# EAGLE board SOC_mcu (EAGLE 6.2), part 1 of 2
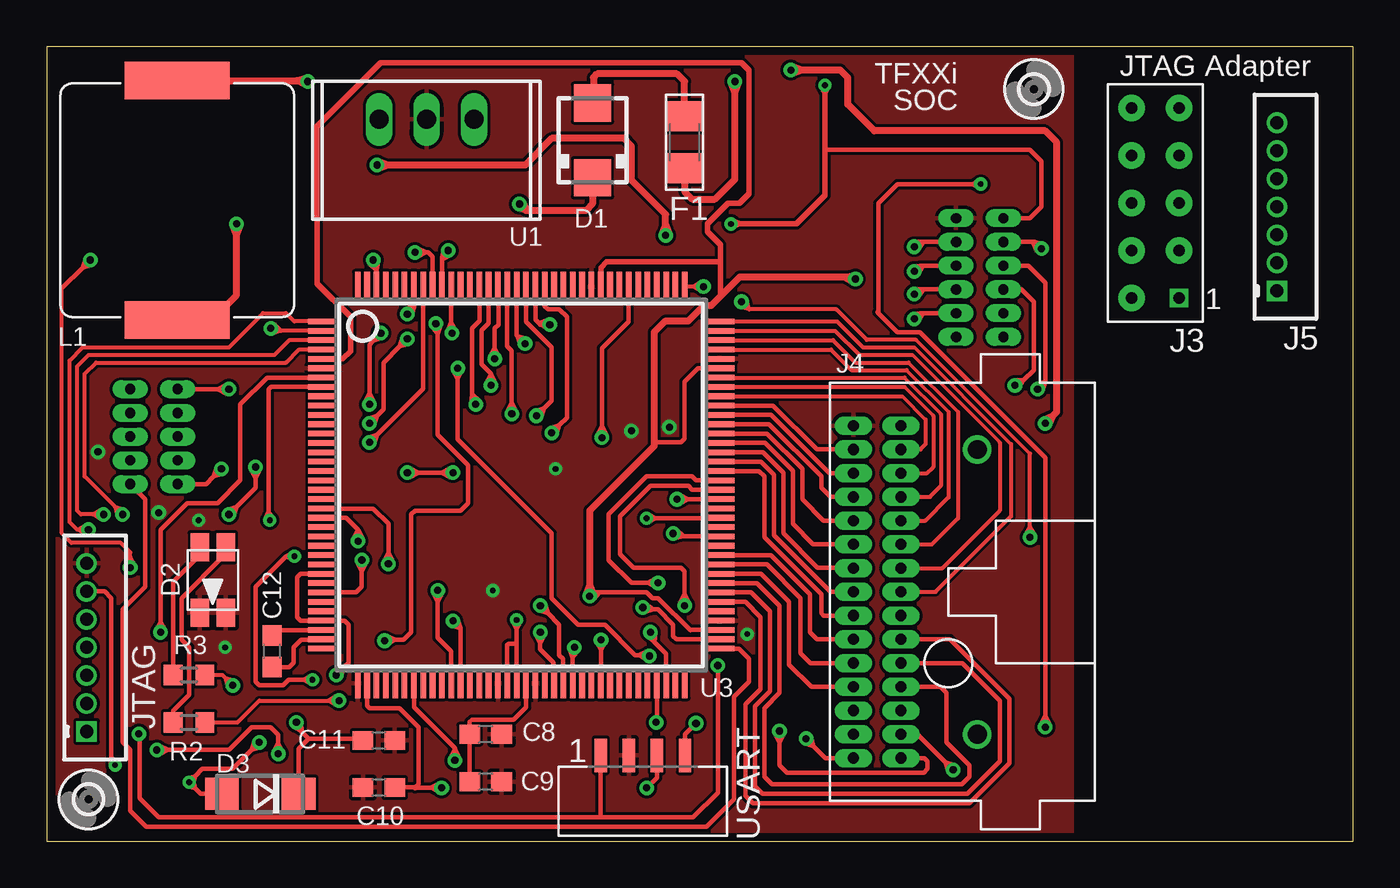
[diagram p5: board, top side]
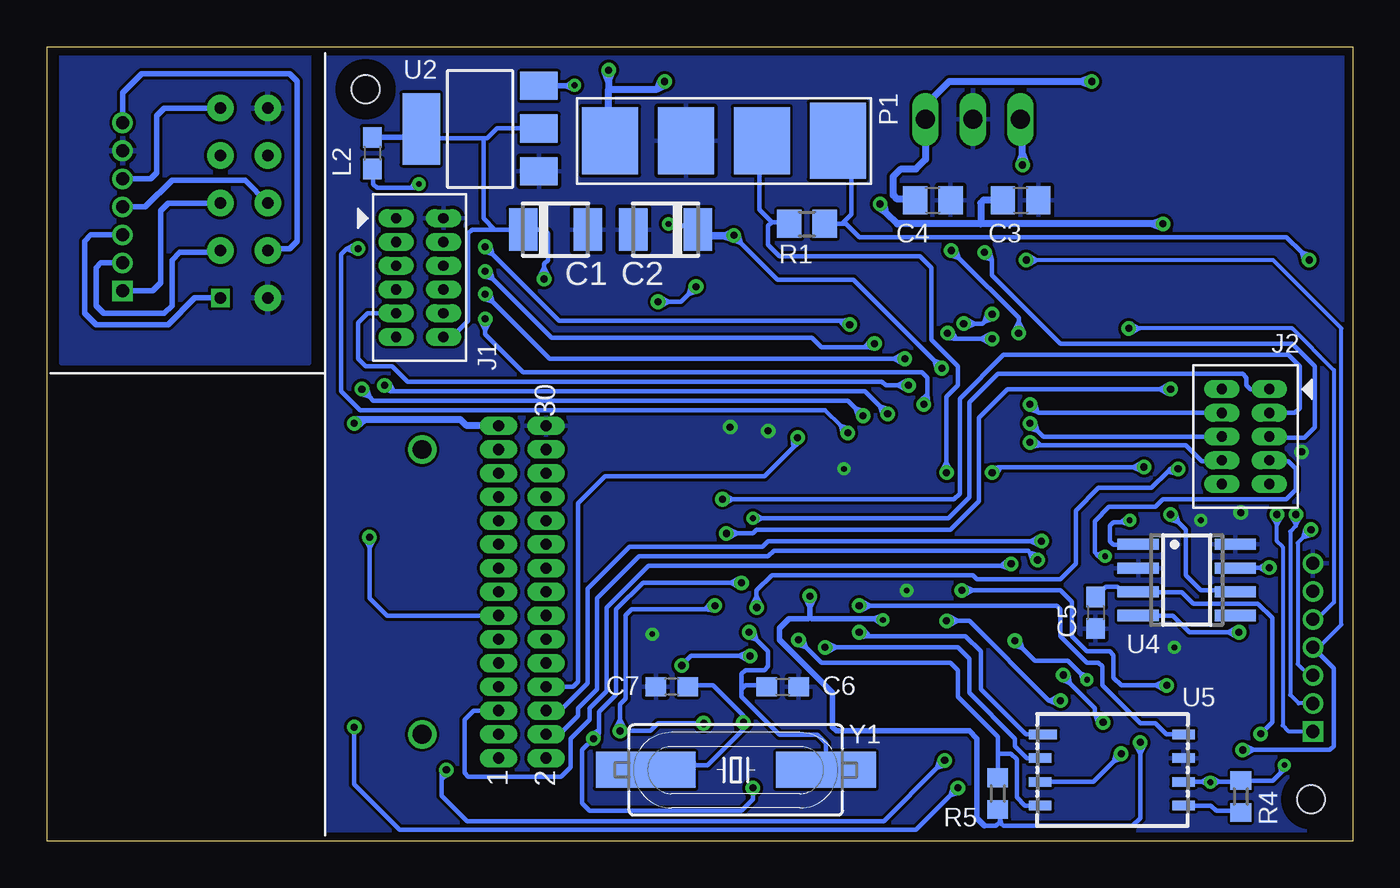
[diagram p6: board, bottom side, seen from below]

Size 69.9 x 42.5 mm. Coordinates in mm from the lower left corner, seen from the top.
Outline: 0,0 69.9,0 69.9,42.5 0,42.5 0,0
Copper layers (1*16): Top 0.018mm / dielectric 1.55mm / 22 0.018mm
Design rules: minimum track width 0.15mm, minimum drill 0.25mm, track to track 0.155mm, track to pad 0.155mm, pad to pad 0.155mm, via to via 0.155mm, smd to smd 0.155mm, copper to edge 0.45mm, drill to drill 0.3mm, minimum pad ring 0.2mm, minimum via ring 0.2mm, stop-mask expansion 0.1mm, vias tented up to drill 0mil, thermal gap 0.2mm

## Footprints (pad centres in the part's own frame; a part is rotated, then mirrored left to right if it is on the bottom)
3528-21 = smd 1.524 x 2.286: NEG 1.727,0; POS -1.727,0
C0805 = smd 1.3 x 1.5: 1 -0.95,0; 2 0.95,0
C0603 = smd 1.1 x 1: 1 -0.85,0; 2 0.85,0
SMA = smd 2 x 2: A 2,0; C -2,0
HSMF-C = smd 1.499 x 0.991: 1 -1.753,0.699; 2 1.753,0.699; 3 -1.753,-0.699; 4 1.753,-0.699
DO214AC = smd 1.8 x 1.7: A 2.05,0; C -2.05,0
1206 = smd 1.6 x 1.8: 1 -1.4,0; 2 1.4,0
1,5 = hole 1.5: 0,0
HEADER-THD-6X2(1.27X2.54) = drill 0.55 pad 0.762 long: 1 0,0; 2 0,2.54; 3 1.27,0; 4 1.27,2.54; 5 2.54,0; 6 2.54,2.54; 7 3.81,0; 8 3.81,2.54; 9 5.08,0; 10 5.08,2.54; 11 6.35,0; 12 6.35,2.54
SOCKET-THD-5X2(1.27X2.54) = drill 0.55 pad 0.762 long: P1 5.08,0; P2 5.08,2.54; P3 3.81,0; P4 3.81,2.54; P5 2.54,0; P6 2.54,2.54; P7 1.27,0; P8 1.27,2.54; P9 0,0; P10 0,2.54
5X2THD254 = drill 0.6 square: 1 5.08,1.27 | drill 0.6 pad 1.422: 2 5.08,-1.27; 3 2.54,1.27; 4 2.54,-1.27; 5 0,1.27; 6 0,-1.27; 7 -2.54,1.27; 8 -2.54,-1.27; 9 -5.08,1.27; 10 -5.08,-1.27
HEADER-THD-15X2(1.27X2.54) = drill 0.6 pad 0.813 long: 1 0,0; 2 0,2.54; 3 1.27,0; 4 1.27,2.54; 5 2.54,0; 6 2.54,2.54; 7 3.81,0; 8 3.81,2.54; 9 5.08,0; 10 5.08,2.54; 11 6.35,0; 12 6.35,2.54; 13 7.62,0; 14 7.62,2.54; 15 8.89,0; 16 8.89,2.54; 17 10.16,0; 18 10.16,2.54; 19 11.43,0; 20 11.43,2.54; 21 12.7,0; 22 12.7,2.54; 23 13.97,0; 24 13.97,2.54; 25 15.24,0; 26 15.24,2.54; 27 16.51,0; 28 16.51,2.54; 29 17.78,0; 30 17.78,2.54 | drill 1 pad 1.524: N1 1.27,-4.089; N2 16.51,-4.089
B7B-ZR = drill 0.7 pad 1.1 square: 1 -4.5,0 | drill 0.7 pad 1.1: 2 -3,0; 3 -1.5,0; 4 0,0; 5 1.5,0; 6 3,0; 7 4.5,0
PAN_COIL_CHOKE = smd 2 x 5.6: 1 -6.4,0; 2 6.4,0
0603 = smd 1.1 x 1: 1 -0.85,0; 2 0.85,0
CAN+POWER = smd 4.083 x 3: 1 0,-6.096 | smd 3.6 x 3: 2 0,-2.032; 3 0,2.032; 4 0,6.096
R0805 = smd 1.3 x 1.5: 1 -0.95,0; 2 0.95,0
R0603 = smd 1 x 1.1: 1 -0.85,0; 2 0.85,0
TO220V = drill 1.016 long: 1 -2.54,2.032; 2 0,2.032; 3 2.54,2.032
SOT223 = smd 1.499 x 2.007: 1 -2.261,-3.15; 2 0.025,-3.15; 3 2.311,-3.15 | smd 3.81 x 2.007: 4 0,3.15
TQFP144 = smd 0.3 x 1.6: 1 -8.75,-10.6; 2 -8.25,-10.6; 3 -7.75,-10.6; 4 -7.25,-10.6; 5 -6.75,-10.6; 6 -6.25,-10.6; 7 -5.75,-10.6; 8 -5.25,-10.6; 9 -4.75,-10.6; 10 -4.25,-10.6; 11 -3.75,-10.6; 12 -3.25,-10.6; 13 -2.75,-10.6; 14 -2.25,-10.6; 15 -1.75,-10.6; 16 -1.25,-10.6; 17 -0.75,-10.6; 18 -0.25,-10.6; 19 0.25,-10.6; 20 0.75,-10.6; 21 1.25,-10.6; 22 1.75,-10.6; 23 2.25,-10.6; 24 2.75,-10.6; 25 3.25,-10.6; 26 3.75,-10.6; 27 4.25,-10.6; 28 4.75,-10.6; 29 5.25,-10.6; 30 5.75,-10.6; 31 6.25,-10.6; 32 6.75,-10.6; 33 7.25,-10.6; 34 7.75,-10.6; 35 8.25,-10.6; 36 8.75,-10.6; 73 8.75,10.6; 74 8.25,10.6; 75 7.75,10.6; 76 7.25,10.6; 77 6.75,10.6; 78 6.25,10.6; 79 5.75,10.6; 80 5.25,10.6; 81 4.75,10.6; 82 4.25,10.6; 83 3.75,10.6; 84 3.25,10.6; 85 2.75,10.6; 86 2.25,10.6; 87 1.75,10.6; 88 1.25,10.6; 89 0.75,10.6; 90 0.25,10.6; 91 -0.25,10.6; 92 -0.75,10.6; 93 -1.25,10.6; 94 -1.75,10.6; 95 -2.25,10.6; 96 -2.75,10.6; 97 -3.25,10.6; 98 -3.75,10.6; 99 -4.25,10.6; 100 -4.75,10.6; 101 -5.25,10.6; 102 -5.75,10.6; 103 -6.25,10.6; 104 -6.75,10.6; 105 -7.25,10.6; 106 -7.75,10.6; 107 -8.25,10.6; 108 -8.75,10.6 | smd 1.6 x 0.3: 37 10.6,-8.75; 38 10.6,-8.25; 39 10.6,-7.75; 40 10.6,-7.25; 41 10.6,-6.75; 42 10.6,-6.25; 43 10.6,-5.75; 44 10.6,-5.25; 45 10.6,-4.75; 46 10.6,-4.25; 47 10.6,-3.75; 48 10.6,-3.25; 49 10.6,-2.75; 50 10.6,-2.25; 51 10.6,-1.75; 52 10.6,-1.25; 53 10.6,-0.75; 54 10.6,-0.25; 55 10.6,0.25; 56 10.6,0.75; 57 10.6,1.25; 58 10.6,1.75; 59 10.6,2.25; 60 10.6,2.75; 61 10.6,3.25; 62 10.6,3.75; 63 10.6,4.25; 64 10.6,4.75; 65 10.6,5.25; 66 10.6,5.75; 67 10.6,6.25; 68 10.6,6.75; 69 10.6,7.25; 70 10.6,7.75; 71 10.6,8.25; 72 10.6,8.75; 109 -10.6,8.75; 110 -10.6,8.25; 111 -10.6,7.75; 112 -10.6,7.25; 113 -10.6,6.75; 114 -10.6,6.25; 115 -10.6,5.75; 116 -10.6,5.25; 117 -10.6,4.75; 118 -10.6,4.25; 119 -10.6,3.75; 120 -10.6,3.25; 121 -10.6,2.75; 122 -10.6,2.25; 123 -10.6,1.75; 124 -10.6,1.25; 125 -10.6,0.75; 126 -10.6,0.25; 127 -10.6,-0.25; 128 -10.6,-0.75; 129 -10.6,-1.25; 130 -10.6,-1.75; 131 -10.6,-2.25; 132 -10.6,-2.75; 133 -10.6,-3.25; 134 -10.6,-3.75; 135 -10.6,-4.25; 136 -10.6,-4.75; 137 -10.6,-5.25; 138 -10.6,-5.75; 139 -10.6,-6.25; 140 -10.6,-6.75; 141 -10.6,-7.25; 142 -10.6,-7.75; 143 -10.6,-8.25; 144 -10.6,-8.75
SO08 = smd 0.6 x 2.2: 1 -1.905,-2.6; 2 -0.635,-2.6; 3 0.635,-2.6; 4 1.905,-2.6; 5 1.905,2.6; 6 0.635,2.6; 7 -0.635,2.6; 8 -1.905,2.6
8CN3 = smd 1.524 x 0.508: 1 -3.937,1.905 | smd 1.219 x 0.508: 2 -4.089,0.635; 3 -4.089,-0.635; 4 -4.089,-1.905; 5 3.59,-1.905; 6 3.59,-0.635; 7 3.59,0.635; 8 3.59,1.905
SM4-TF = smd 0.65 x 1.8: 1 -2.25,-0.9; 2 -0.75,-0.9; 3 0.75,-0.9; 4 2.25,-0.9
HC49UP = smd 5.334 x 1.93: 1 -4.826,0; 2 4.826,0

## Placement (x,y rotation side)
C1  100uF  [3528-21]  42.67,32.72 0 bottom
C2  10uF  [3528-21]  36.78,32.72 180 bottom
C3  4.7uF  [C0805]  17.78,34.29 0 bottom
C4  4.7uF  [C0805]  22.48,34.29 0 bottom
C5  100n  [C0603]  13.77,12.22 270 bottom
C6  22p  [C0603]  30.51,8.26 0 bottom
C7  22p  [C0603]  36.45,8.26 180 bottom
C8  470p  [C0603]  23.5,5.71 180 top
C9  2.2u  [C0603]  23.5,3.17 180 top
C10  100n  [C0603]  17.78,2.87 180 top
C11  100n  [C0603]  17.78,5.38 0 top
C12  100n  [C0603]  12.06,10.16 90 top
D1  MBRA340T3  [SMA]  29.21,37.49 90 top
D2  HSMF-C155  [HSMF-C]  8.89,13.97 270 top
D3  MRA4003T3G  [DO214AC]  11.43,2.54 180 top
F1  SMDC050F-0.5A-1206  [1206]  34.14,37.39 90 top
H1  MOUNT-HOLE1.5  [1,5]  2.24,2.24 0 top
H2  MOUNT-HOLE1.5  [1,5]  52.83,40.23 0 top
J1  HEADER-6X2-1.27-2.54  [HEADER-THD-6X2(1.27X2.54)]  51.21,33.32 270 bottom
J2  SOCKET-5X2-1.27X2.54  [SOCKET-THD-5X2(1.27X2.54)]  4.47,19.1 90 bottom
J3  PIN5X2THD254  [5X2THD254]  59.33,34.14 270 top
J4  HEADER-15X2-1.27X2.54  [HEADER-THD-15X2(1.27X2.54)]  45.72,4.45 90 top
J5  B7B-ZR  [B7B-ZR]  65.84,33.93 90 top
JTAG  B7B-ZR  [B7B-ZR]  2.13,10.36 90 top
L1  ETQP6F8R2HFA  [PAN_COIL_CHOKE]  6.99,34.29 90 top
L2  BLM18H  [0603]  52.48,36.8 270 bottom
P1  PADS4  [CAN+POWER]  33.66,37.47 90 bottom
R1  120  [R0805]  29.21,33.02 0 bottom
R2  68  [R0603]  7.62,6.35 180 top
R3  68  [R0603]  7.62,8.89 180 top
R4  100k  [R0603]  5.99,2.39 270 bottom
R5  100k  [R0603]  19,2.54 90 bottom
U1  TSR1-2450  [TO220V]  20.32,40.64 180 top
U2  TLV1117-33  [SOT223]  46.71,38.1 90 bottom
U3  ATUC3C0512C  [TQFP144]  25.4,19.05 270 top
U4  MCP2551  [SO08]  8.89,13.97 270 bottom
U5  AT45DB642D-SPI  [8CN3]  12.65,3.81 0 bottom
USART  B4B-ZRSMT  [SM4-TF]  31.9,5.49 0 top
Y1  CRYSTAL_49SMX  [HC49UP]  33.02,3.81 0 bottom

## Tracks (layer width: path | path; a pad name or v marks a point on that pad's centre or on a via)
!TFT_CS
  Top 0.254: U3.79 37.69,13.31 38.71,12.29 38.71,8.03 37.9,7.21 37.9,2.95 38.3,2.54 49.28,2.54 51,4.27 51,7.52 49,9.53 J4.9
!TFT_RD
  Top 0.254: U3.83 38.75,15.3 40.84,13.21 40.84,11.18 41.22,10.79 J4.12
!TFT_RESET  (via drill 0.38)
  Top 0.254: U3.81 38.23,14.3 39.73,12.8 39.73,9.45 40.92,8.26 J4.8 | v29.72,21.59 29.72,22.16 | 29.72,22.16 29.72,26.36 31.15,27.8 U3.115 | 29.72,22.16 | 29.72,22.16 29.48,21.71 | v29.72,21.59 29.48,21.71 | 29.72,22.16 | 29.72,22.16 29.95,21.71 | v29.72,21.59 29.95,21.71 | 29.72,22.16 29.48,21.71 | 29.48,21.71 | v29.72,21.59 29.48,21.71 | 29.72,22.16 29.95,21.71 | v29.72,21.59 29.95,21.71 | 29.72,22.16 29.48,21.71 | v29.72,21.59 29.48,21.71 | 29.72,22.16 29.95,21.71 | v29.72,21.59 29.95,21.71
  22 0.254: J4.8 41.73,8.26 41.45,8.53 41.45,18.09 40.03,19.51 31.5,19.51 29.94,21.06 | 29.94,21.06 29.72,21.29 v29.72,21.59 | 29.94,21.06 29.98,21.57 v29.72,21.59 | 29.94,21.06 29.55,21.39 v29.72,21.59
!TFT_WR
  Top 0.254: J4.11 48.34,10.79 51.51,7.62 51.51,4.17 49.38,2.03 37.8,2.03 37.39,2.44 37.39,7.32 38.2,8.13 38.2,11.99 37.39,12.8 U3.78
CAN_H  (via drill 0.38)
  Top 0.203: 0.81,29.57 0.81,16.46 1.32,15.95 3.96,15.95 4.47,15.44 4.47,15.2 | v4.47,14.63 4.47,15.2 | 4.47,15.2 | 4.47,15.2 | 4.47,15.2 4.22,14.78 | v4.47,14.63 4.22,14.78 | 4.47,15.2 4.72,14.78 | v4.47,14.63 4.72,14.78 | 4.47,15.2 4.22,14.78 | v4.47,14.63 4.22,14.78 | 4.47,15.2 4.72,14.78 | v4.47,14.63 4.72,14.78 | 4.47,15.2 4.22,14.78 | v4.47,14.63 4.22,14.78 | 4.47,15.2 4.72,14.78 | v4.47,14.63 4.72,14.78
  Top 0.254: 0.81,29.57 1.93,30.68 | 1.93,30.68 v2.34,31.09 | 1.93,30.68 2.42,30.84 v2.34,31.09 | 1.93,30.68 2.09,31.17 v2.34,31.09
  22 0.203: 6.26,14.63 U4.7
  22 0.254: R1.2 27.33,33.02 | v4.47,14.63 5.04,14.63 | 5.04,14.63 6.26,14.63 | v2.34,31.09 2.74,31.49 | 2.74,31.49 3.56,32.31 26.42,32.31 27.13,33.02 27.33,33.02 | 26.82,35.97 26.82,33.53 27.33,33.02 | 2.74,31.49 2.26,31.34 v2.34,31.09 | 2.74,31.49 2.59,31.01 v2.34,31.09 | 5.04,14.63 4.59,14.86 | v4.47,14.63 4.59,14.86 | 5.04,14.63 4.59,14.4 | v4.47,14.63 4.59,14.4 | 5.04,14.63 4.59,14.86 | 4.59,14.86 | v4.47,14.63 4.59,14.86 | 5.04,14.63 4.59,14.4 | v4.47,14.63 4.59,14.4 | 5.04,14.63 4.59,14.86 | v4.47,14.63 4.59,14.86 | 5.04,14.63 4.59,14.4 | v4.47,14.63 4.59,14.4
  22 0.381: P1.1 27.56,36.7 26.82,35.97
CAN_L  (via drill 0.38)
  Top 0.254: v21.74,19.71 21.17,19.71 | 21.17,19.71 19.88,19.71 | 19.88,19.71 v19.3,19.71 | v11.18,20.02 11.18,19.44 | 11.18,19.44 11.18,18.9 10.16,17.88 | 10.16,17.88 v9.75,17.48 | 21.17,19.71 | 21.17,19.71 21.62,19.48 | v21.74,19.71 21.62,19.48 | 21.17,19.71 | 21.17,19.71 21.62,19.94 | v21.74,19.71 21.62,19.94 | 21.17,19.71 21.62,19.48 | 21.62,19.48 | v21.74,19.71 21.62,19.48 | 21.17,19.71 21.62,19.94 | v21.74,19.71 21.62,19.94 | 21.17,19.71 21.62,19.48 | v21.74,19.71 21.62,19.48 | 21.17,19.71 21.62,19.94 | v21.74,19.71 21.62,19.94 | 19.88,19.71 19.43,19.94 | v19.3,19.71 19.43,19.94 | 19.88,19.71 19.43,19.48 | v19.3,19.71 19.43,19.48 | 19.88,19.71 19.43,19.94 | 19.43,19.94 | v19.3,19.71 19.43,19.94 | 19.88,19.71 19.43,19.48 | v19.3,19.71 19.43,19.48 | 19.88,19.71 19.43,19.94 | v19.3,19.71 19.43,19.94 | 19.88,19.71 19.43,19.48 | v19.3,19.71 19.43,19.48 | 11.18,19.44 11.41,19.89 | v11.18,20.02 11.41,19.89 | 11.18,19.44 10.94,19.89 | v11.18,20.02 10.94,19.89 | 11.18,19.44 11.41,19.89 | 11.41,19.89 | v11.18,20.02 11.41,19.89 | 11.18,19.44 10.94,19.89 | v11.18,20.02 10.94,19.89 | 11.18,19.44 11.41,19.89 | v11.18,20.02 11.41,19.89 | 11.18,19.44 10.94,19.89 | v11.18,20.02 10.94,19.89 | 10.16,17.88 9.67,17.73 v9.75,17.48 | 10.16,17.88 10.01,17.4 v9.75,17.48
  22 0.203: 6.37,13.41 U4.6
  22 0.254: P1.2 31.75,36.83 31.75,33.78 31.09,33.12 | v9.75,17.48 9.35,17.07 | 9.35,17.07 8.94,16.66 8.94,14.22 8.13,13.41 6.37,13.41 | 21.74,20.28 21.74,23.77 21.13,24.38 21.13,25.4 22.55,26.82 22.55,30.68 23.16,31.29 30.68,31.29 31.29,31.9 31.29,32.92 31.09,33.12 | 21.74,20.28 v21.74,19.71 | v11.18,20.02 11.75,20.02 | 11.75,20.02 18.82,20.02 | 18.82,20.02 19,20.02 v19.3,19.71 | 31.09,33.12 30.16,33.12 | 21.74,20.28 | 21.74,20.28 21.51,19.83 | v21.74,19.71 21.51,19.83 | 21.74,20.28 | 21.74,20.28 21.98,19.83 | v21.74,19.71 21.98,19.83 | 21.74,20.28 21.51,19.83 | 21.51,19.83 | v21.74,19.71 21.51,19.83 | 21.74,20.28 21.98,19.83 | v21.74,19.71 21.98,19.83 | 21.74,20.28 21.51,19.83 | v21.74,19.71 21.51,19.83 | 21.74,20.28 21.98,19.83 | v21.74,19.71 21.98,19.83 | 18.82,20.02 19.08,19.58 v19.3,19.71 | 18.82,20.02 19.33,19.97 v19.3,19.71 | 11.75,20.02 11.3,20.25 | v11.18,20.02 11.3,20.25 | 11.75,20.02 11.3,19.78 | v11.18,20.02 11.3,19.78 | 11.75,20.02 11.3,20.25 | 11.3,20.25 | v11.18,20.02 11.3,20.25 | 11.75,20.02 11.3,19.78 | v11.18,20.02 11.3,19.78 | 11.75,20.02 11.3,20.25 | v11.18,20.02 11.3,20.25 | 11.75,20.02 11.3,19.78 | v11.18,20.02 11.3,19.78 | 9.35,17.07 9.83,17.22 v9.75,17.48 | 9.35,17.07 9.5,17.55 v9.75,17.48
  22 0.381: 30.16,33.12 R1.1
CAN_RXD0  (via drill 0.38)
  Top 0.203: U3.7
  Top 0.254: v6.1,11.18 6.1,11.75 | 6.1,11.75 6.1,16.66 7.52,18.09 9.14,18.09 10.36,19.3 10.36,23.37 11.79,24.79 U3.7 | 6.1,11.75 | 6.1,11.75 5.86,11.3 | v6.1,11.18 5.86,11.3 | 6.1,11.75 | 6.1,11.75 6.33,11.3 | v6.1,11.18 6.33,11.3 | 6.1,11.75 5.86,11.3 | 5.86,11.3 | v6.1,11.18 5.86,11.3 | 6.1,11.75 6.33,11.3 | v6.1,11.18 6.33,11.3 | 6.1,11.75 5.86,11.3 | v6.1,11.18 5.86,11.3 | 6.1,11.75 6.33,11.3 | v6.1,11.18 6.33,11.3
  22 0.254: 6.67,11.18 8.74,11.18 9.63,12.06 U4.4 | 6.67,11.18 v6.1,11.18 | 6.67,11.18 6.22,11.41 | v6.1,11.18 6.22,11.41 | 6.67,11.18 6.22,10.94 | v6.1,11.18 6.22,10.94 | 6.67,11.18 6.22,11.41 | 6.22,11.41 | v6.1,11.18 6.22,11.41 | 6.67,11.18 6.22,10.94 | v6.1,11.18 6.22,10.94 | 6.67,11.18 6.22,11.41 | v6.1,11.18 6.22,11.41 | 6.67,11.18 6.22,10.94 | v6.1,11.18 6.22,10.94
CAN_TXD0  (via drill 0.3)
  Top 0.254: U3.8 12.01,24.3 11.89,24.18 11.89,17.62 | 11.89,17.62 11.89,17.22 v11.94,17.17 | 11.89,17.62 11.73,17.26 v11.94,17.17 | 11.89,17.62 12.12,17.3 v11.94,17.17
  22 0.15: 11.68,16 U4.1
  22 0.254: 11.68,16 12.04,16 12.19,15.85 12.8,15.85 13.01,16.05 13.01,16.87 12.8,17.07 12.38,17.07 | 12.38,17.07 12.04,17.07 v11.94,17.17 | 12.38,17.07 12.09,17.34 v11.94,17.17 | 12.38,17.07 12,16.95 v11.94,17.17
CMOS_D0  (via drill 0.38)
  Top 0.254: U3.124 26.65,28.62 26.82,28.45 27.43,28.45 27.84,28.04 27.84,22.66 27.43,22.25 | 27.43,22.25 v27.03,21.84 | J1.3 52.79,32.05 | 52.79,32.05 52.88,32.05 v53.24,31.7 | 52.79,32.05 53,31.59 v53.24,31.7 | 52.79,32.05 53.29,31.96 v53.24,31.7 | 27.43,22.25 26.95,22.09 v27.03,21.84 | 27.43,22.25 27.28,21.77 v27.03,21.84
  22 0.203: 28.25,23.06 27.43,22.25 | 27.43,22.25 v27.03,21.84 | 27.43,22.25 26.95,22.12 v27.03,21.84 | 27.43,22.25 27.3,21.77 v27.03,21.84
  22 0.254: 28.25,23.06 53.14,23.06 54.15,24.08 54.15,31.39 53.85,31.7 53.81,31.7 | 53.81,31.7 v53.24,31.7 | 53.81,31.7 53.36,31.93 | v53.24,31.7 53.36,31.93 | 53.81,31.7 53.36,31.46 | v53.24,31.7 53.36,31.46 | 53.81,31.7 53.36,31.93 | 53.36,31.93 | v53.24,31.7 53.36,31.93 | 53.81,31.7 53.36,31.46 | v53.24,31.7 53.36,31.46 | 53.81,31.7 53.36,31.93 | v53.24,31.7 53.36,31.93 | 53.81,31.7 53.36,31.46 | v53.24,31.7 53.36,31.46
CMOS_D1  (via drill 0.38)
  Top 0.254: U3.125 26.15,27.9 26.36,27.7 | 26.36,27.7 26.42,27.64 v26.92,27.64 | J1.4 46.94,32.05 | 46.94,32.05 46.69,32.05 v46.43,31.8 | 46.94,32.05 46.44,32.06 v46.43,31.8 | 46.94,32.05 46.64,31.64 v46.43,31.8 | 26.36,27.7 26.78,27.42 v26.92,27.64 | 26.36,27.7 26.83,27.88 v26.92,27.64
  22 0.254: 27.46,27.84 42.47,27.84 46.03,31.4 | 27.46,27.84 27.13,27.84 v26.92,27.64 | 46.03,31.4 v46.43,31.8 | 46.03,31.4 46.51,31.55 v46.43,31.8 | 46.03,31.4 46.18,31.88 v46.43,31.8 | 27.46,27.84 26.95,27.9 v26.92,27.64 | 27.46,27.84 27.12,27.46 v26.92,27.64
CMOS_D2  (via drill 0.38)
  Top 0.254: v53.03,24.18 53.44,24.59 | 53.44,24.59 53.44,29.87 52.53,30.79 J1.5 | U3.126 25.65,27.79 27.03,26.42 27.03,23.57 26.62,23.16 | 26.62,23.16 v26.21,22.76 | 26.62,23.16 26.13,23.01 v26.21,22.76 | 26.62,23.16 26.46,22.68 v26.21,22.76 | 53.44,24.59 52.96,24.43 v53.03,24.18 | 53.44,24.59 53.29,24.1 v53.03,24.18
  22 0.254: 26.62,23.16 27.03,23.57 52.43,23.57 52.63,23.78 | 26.62,23.16 v26.21,22.76 | 52.63,23.78 v53.03,24.18 | 26.62,23.16 26.13,23.01 v26.21,22.76 | 26.62,23.16 26.46,22.68 v26.21,22.76 | 52.63,23.78 53.12,23.93 v53.03,24.18 | 52.63,23.78 52.78,24.26 v53.03,24.18
CMOS_D3  (via drill 0.38)
  Top 0.254: J1.6 46.91,30.79 | 46.91,30.79 46.74,30.79 v46.43,30.48 | U3.127 25.15,27.07 25.2,27.02 | 25.2,27.02 v25.6,26.62 | 46.91,30.79 46.41,30.74 v46.43,30.48 | 46.91,30.79 46.66,30.35 v46.43,30.48 | 25.2,27.02 25.35,26.54 v25.6,26.62 | 25.2,27.02 25.68,26.87 v25.6,26.62
  22 0.254: 46.03,30.08 42.88,26.92 28.96,26.92 28.45,26.42 26.14,26.42 | 46.03,30.08 v46.43,30.48 | 26.14,26.42 25.81,26.42 v25.6,26.62 | 46.03,30.08 46.51,30.23 v46.43,30.48 | 46.03,30.08 46.18,30.56 v46.43,30.48 | 26.14,26.42 25.8,26.8 v25.6,26.62 | 26.14,26.42 25.63,26.36 v25.6,26.62
CMOS_D4  (via drill 0.38)
  Top 0.254: U3.128 24.65,26.48 24.89,26.24 24.89,23.43 | v24.89,22.86 24.89,23.43 | v51.82,24.38 52.02,24.38 52.31,24.67 | 52.31,24.67 52.83,25.2 52.83,28.85 52.17,29.52 J1.7 | 52.31,24.67 51.8,24.65 v51.82,24.38 | 52.31,24.67 52.04,24.24 v51.82,24.38 | 24.89,23.43 | 24.89,23.43 24.66,22.98 | v24.89,22.86 24.66,22.98 | 24.89,23.43 | 24.89,23.43 25.13,22.98 | v24.89,22.86 25.13,22.98 | 24.89,23.43 24.66,22.98 | 24.66,22.98 | v24.89,22.86 24.66,22.98 | 24.89,23.43 25.13,22.98 | v24.89,22.86 25.13,22.98 | 24.89,23.43 24.66,22.98 | v24.89,22.86 24.66,22.98 | 24.89,23.43 25.13,22.98 | v24.89,22.86 25.13,22.98
  22 0.254: 51.33,24.08 51.51,24.08 v51.82,24.38 | 51.33,24.08 26.11,24.08 25.3,23.26 | v24.89,22.86 25.3,23.26 | 51.33,24.08 51.84,24.12 v51.82,24.38 | 51.33,24.08 51.59,24.52 v51.82,24.38 | 25.3,23.26 24.81,23.11 v24.89,22.86 | 25.3,23.26 25.14,22.78 v24.89,22.86
CMOS_D5  (via drill 0.38)
  Top 0.203: 24.18,29.62 U3.129
  Top 0.254: v23.98,25.81 23.98,26.38 | 23.98,26.38 23.98,27.43 24.18,27.64 24.18,29.62 | J1.8 46.94,29.52 | 46.94,29.52 46.69,29.52 v46.43,29.26 | 46.94,29.52 46.44,29.52 v46.43,29.26 | 46.94,29.52 46.64,29.11 v46.43,29.26 | 23.98,26.38 | 23.98,26.38 23.74,25.93 | v23.98,25.81 23.74,25.93 | 23.98,26.38 | 23.98,26.38 24.21,25.93 | v23.98,25.81 24.21,25.93 | 23.98,26.38 23.74,25.93 | 23.74,25.93 | v23.98,25.81 23.74,25.93 | 23.98,26.38 24.21,25.93 | v23.98,25.81 24.21,25.93 | 23.98,26.38 23.74,25.93 | v23.98,25.81 23.74,25.93 | 23.98,26.38 24.21,25.93 | v23.98,25.81 24.21,25.93
  22 0.254: v23.98,25.81 24.55,25.81 | 24.55,25.81 42.98,25.81 46.03,28.86 | 46.03,28.86 v46.43,29.26 | 46.03,28.86 46.51,29.01 v46.43,29.26 | 46.03,28.86 46.18,29.34 v46.43,29.26 | 24.55,25.81 24.1,26.04 | v23.98,25.81 24.1,26.04 | 24.55,25.81 24.1,25.57 | v23.98,25.81 24.1,25.57 | 24.55,25.81 24.1,26.04 | 24.1,26.04 | v23.98,25.81 24.1,26.04 | 24.55,25.81 24.1,25.57 | v23.98,25.81 24.1,25.57 | 24.55,25.81 24.1,26.04 | v23.98,25.81 24.1,26.04 | 24.55,25.81 24.1,25.57 | v23.98,25.81 24.1,25.57
CMOS_D6  (via drill 0.38)
  Top 0.254: U3.130 23.65,27.71 23.27,27.33 23.27,25.5 23.77,24.99 23.77,24.96 | 23.77,24.96 v23.77,24.38 | 23.77,24.96 | 23.77,24.96 23.54,24.5 | v23.77,24.38 23.54,24.5 | 23.77,24.96 | 23.77,24.96 24.01,24.5 | v23.77,24.38 24.01,24.5 | 23.77,24.96 23.54,24.5 | 23.54,24.5 | v23.77,24.38 23.54,24.5 | 23.77,24.96 24.01,24.5 | v23.77,24.38 24.01,24.5 | 23.77,24.96 23.54,24.5 | v23.77,24.38 23.54,24.5 | 23.77,24.96 24.01,24.5 | v23.77,24.38 24.01,24.5
  22 0.254: J1.9 52.73,28.25 53.24,27.74 53.24,25.81 52.83,25.4 51.41,25.4 50.6,24.59 25.2,24.59 24.99,24.38 24.35,24.38 | v23.77,24.38 24.35,24.38 | 24.35,24.38 23.9,24.62 | v23.77,24.38 23.9,24.62 | 24.35,24.38 23.9,24.15 | v23.77,24.38 23.9,24.15 | 24.35,24.38 23.9,24.62 | 23.9,24.62 | v23.77,24.38 23.9,24.62 | 24.35,24.38 23.9,24.15 | v23.77,24.38 23.9,24.15 | 24.35,24.38 23.9,24.62 | v23.77,24.38 23.9,24.62 | 24.35,24.38 23.9,24.15 | v23.77,24.38 23.9,24.15
CMOS_D7  (via drill 0.38)
  Top 0.203: 23.16,29.64 U3.131
  Top 0.254: 23.16,29.64 23.16,27.84 22.76,27.43 22.76,23.9 | 22.76,23.9 22.76,23.57 v22.96,23.37 | J1.10 46.91,28.25 | 46.91,28.25 46.74,28.25 v46.43,27.94 | 46.91,28.25 46.41,28.2 v46.43,27.94 | 46.91,28.25 46.66,27.81 v46.43,27.94 | 22.76,23.9 22.7,23.4 v22.96,23.37 | 22.76,23.9 23.14,23.57 v22.96,23.37
  22 0.254: 22.76,23.9 22.76,24.79 23.06,25.09 44.4,25.09 46.43,27.13 46.43,27.37 | 22.76,23.9 22.76,23.57 v22.96,23.37 | 46.43,27.37 v46.43,27.94 | 46.43,27.37 46.66,27.82 | v46.43,27.94 46.66,27.82 | 46.43,27.37 46.2,27.82 | v46.43,27.94 46.2,27.82 | 46.43,27.37 46.66,27.82 | 46.66,27.82 | v46.43,27.94 46.66,27.82 | 46.43,27.37 46.2,27.82 | v46.43,27.94 46.2,27.82 | 46.43,27.37 46.66,27.82 | v46.43,27.94 46.66,27.82 | 46.43,27.37 46.2,27.82 | v46.43,27.94 46.2,27.82 | 22.76,23.9 22.7,23.4 v22.96,23.37 | 22.76,23.9 23.14,23.57 v22.96,23.37
CMOS_EXTCLK  (via drill 0.38)
  Top 0.254: J2.P2 9.18,24.18 | 9.18,24.18 v9.75,24.18 | U3.85 34.08,16.3 | 34.08,16.3 33.69,16.3 v33.53,16.46 | 9.18,24.18 | 9.18,24.18 9.63,23.95 | v9.75,24.18 9.63,23.95 | 9.18,24.18 | 9.18,24.18 9.63,24.41 | v9.75,24.18 9.63,24.41 | 9.18,24.18 9.63,23.95 | 9.63,23.95 | v9.75,24.18 9.63,23.95 | 9.18,24.18 9.63,24.41 | v9.75,24.18 9.63,24.41 | 9.18,24.18 9.63,23.95 | v9.75,24.18 9.63,23.95 | 9.18,24.18 9.63,24.41 | v9.75,24.18 9.63,24.41 | 34.08,16.3 33.71,16.65 v33.53,16.46 | 34.08,16.3 33.58,16.2 v33.53,16.46
  22 0.254: v9.75,24.18 10.32,24.18 | 10.32,24.18 18.49,24.18 20.02,22.66 20.02,18.19 21.54,16.66 31.9,16.66 32.11,16.46 32.96,16.46 | 32.96,16.46 v33.53,16.46 | 10.32,24.18 9.88,24.41 | v9.75,24.18 9.88,24.41 | 10.32,24.18 9.88,23.95 | v9.75,24.18 9.88,23.95 | 10.32,24.18 9.88,24.41 | 9.88,24.41 | v9.75,24.18 9.88,24.41 | 10.32,24.18 9.88,23.95 | v9.75,24.18 9.88,23.95 | 10.32,24.18 9.88,24.41 | v9.75,24.18 9.88,24.41 | 10.32,24.18 9.88,23.95 | v9.75,24.18 9.88,23.95 | 32.96,16.46 | 32.96,16.46 33.41,16.23 | v33.53,16.46 33.41,16.23 | 32.96,16.46 | 32.96,16.46 33.41,16.69 | v33.53,16.46 33.41,16.69 | 32.96,16.46 33.41,16.23 | 33.41,16.23 | v33.53,16.46 33.41,16.23 | 32.96,16.46 33.41,16.69 | v33.53,16.46 33.41,16.69 | 32.96,16.46 33.41,16.23 | v33.53,16.46 33.41,16.23 | 32.96,16.46 33.41,16.69 | v33.53,16.46 33.41,16.69
CMOS_FV  (via drill 0.38)
  Top 0.254: 21.18,31.29 v21.49,31.6 | v17.27,23.37 17.27,23.94 | 17.27,23.94 17.27,26.57 17.48,26.77 | 17.48,26.77 v17.88,27.18 | U3.135 21.15,31.14 | 21.15,31.14 21.15,31.26 v21.49,31.6 | 21.15,31.14 21.61,31.36 v21.49,31.6 | 21.15,31.14 21.23,31.64 v21.49,31.6 | 17.48,26.77 17.96,26.93 v17.88,27.18 | 17.48,26.77 17.63,27.26 v17.88,27.18 | 17.27,23.94 | 17.27,23.94 17.04,23.49 | v17.27,23.37 17.04,23.49 | 17.27,23.94 | 17.27,23.94 17.51,23.49 | v17.27,23.37 17.51,23.49 | 17.27,23.94 17.04,23.49 | 17.04,23.49 | v17.27,23.37 17.04,23.49 | 17.27,23.94 17.51,23.49 | v17.27,23.37 17.51,23.49 | 17.27,23.94 17.04,23.49 | v17.27,23.37 17.04,23.49 | 17.27,23.94 17.51,23.49 | v17.27,23.37 17.51,23.49
  22 0.254: 21.08,31.19 17.88,27.99 17.88,27.75 | 21.08,31.19 v21.49,31.6 | v17.88,27.18 17.88,27.75 | J2.P4 16.82,22.91 16.87,22.96 | 16.87,22.96 v17.27,23.37 | 21.08,31.19 21.57,31.35 v21.49,31.6 | 21.08,31.19 21.24,31.68 v21.49,31.6 | 17.88,27.75 | 17.88,27.75 17.65,27.3 | v17.88,27.18 17.65,27.3 | 17.88,27.75 | 17.88,27.75 18.11,27.3 | v17.88,27.18 18.11,27.3 | 17.88,27.75 17.65,27.3 | 17.65,27.3 | v17.88,27.18 17.65,27.3 | 17.88,27.75 18.11,27.3 | v17.88,27.18 18.11,27.3 | 17.88,27.75 17.65,27.3 | v17.88,27.18 17.65,27.3 | 17.88,27.75 18.11,27.3 | v17.88,27.18 18.11,27.3 | 16.87,22.96 17.35,23.12 v17.27,23.37 | 16.87,22.96 17.02,23.45 v17.27,23.37
CMOS_LV  (via drill 0.38)
  Top 0.254: 18.9,26.47 18.03,25.6 18.03,23.11 17.68,22.76 | 18.9,26.47 v19.3,26.87 | v17.27,22.35 17.68,22.76 | U3.134 21.65,27.75 | 21.65,27.75 21.65,27.22 v21.69,27.18 | 21.65,27.75 21.45,27.28 v21.69,27.18 | 21.65,27.75 21.92,27.32 v21.69,27.18 | 18.9,26.47 19.38,26.62 v19.3,26.87 | 18.9,26.47 19.05,26.95 v19.3,26.87 | 17.68,22.76 17.19,22.6 v17.27,22.35 | 17.68,22.76 17.52,22.27 v17.27,22.35
  22 0.254: v19.3,26.87 19.88,26.87 | 19.88,26.87 21.21,26.87 | 21.21,26.87 21.39,26.87 v21.69,27.18 | J2.P6 16.56,21.64 16.87,21.95 | 16.87,21.95 v17.27,22.35 | 21.21,26.87 21.71,26.91 v21.69,27.18 | 21.21,26.87 21.46,27.31 v21.69,27.18 | 19.88,26.87 19.43,27.11 | v19.3,26.87 19.43,27.11 | 19.88,26.87 19.43,26.64 | v19.3,26.87 19.43,26.64 | 19.88,26.87 19.43,27.11 | 19.43,27.11 | v19.3,26.87 19.43,27.11 | 19.88,26.87 19.43,26.64 | v19.3,26.87 19.43,26.64 | 19.88,26.87 19.43,27.11 | v19.3,26.87 19.43,27.11 | 19.88,26.87 19.43,26.64 | v19.3,26.87 19.43,26.64 | 16.87,21.95 17.35,22.1 v17.27,22.35 | 16.87,21.95 17.02,22.43 v17.27,22.35
CMOS_PIXCLK  (via drill 0.38)
  Top 0.254: v19.71,31.5 20.28,31.5 | 20.28,31.5 20.42,31.5 20.65,31.27 U3.136 | 20.28,31.5 19.83,31.73 | v19.71,31.5 19.83,31.73 | 20.28,31.5 19.83,31.26 | v19.71,31.5 19.83,31.26 | 20.28,31.5 19.83,31.73 | 19.83,31.73 | v19.71,31.5 19.83,31.73 | 20.28,31.5 19.83,31.26 | v19.71,31.5 19.83,31.26 | 20.28,31.5 19.83,31.73 | v19.71,31.5 19.83,31.73 | 20.28,31.5 19.83,31.26 | v19.71,31.5 19.83,31.26
  22 0.254: 19.31,31.09 19.3,31.09 19.3,30.28 15.65,26.62 3.25,26.62 2.03,25.4 2.03,22.15 2.59,21.59 4.42,21.59 J2.P5 | 19.31,31.09 v19.71,31.5 | 19.31,31.09 19.79,31.25 v19.71,31.5 | 19.31,31.09 19.46,31.57 v19.71,31.5
CMOS_RESET  (via drill 0.3, 0.38)
  Top 0.254: 13.77,8.64 12.95,8.64 12.65,8.33 11.38,8.33 11.18,8.53 11.18,13.61 12.8,15.24 | 13.77,8.64 v14.22,8.64 | 20.93,27.12 20.93,21.74 22.55,20.12 22.55,18.09 22.15,17.68 19.71,17.68 19.51,17.48 19.51,11.18 19.1,10.77 18.65,10.77 | 20.93,27.12 20.93,27.58 v20.83,27.69 | U3.138 19.65,28.65 | 19.65,28.65 19.65,28.54 v19.3,28.19 | 18.65,10.77 18.14,10.77 v18.09,10.72 | 12.8,15.24 v13.26,15.24 | 19.65,28.65 19.19,28.43 v19.3,28.19 | 19.65,28.65 19.56,28.15 v19.3,28.19 | 20.93,27.12 21.08,27.61 v20.83,27.69 | 20.93,27.12 20.62,27.52 v20.83,27.69 | 18.65,10.77 18.18,10.96 v18.09,10.72 | 18.65,10.77 18.23,10.5 v18.09,10.72 | 13.77,8.64 | 13.77,8.64 14.11,8.44 | v14.22,8.64 14.11,8.44 | 13.77,8.64 | 13.77,8.64 14.11,8.83 | v14.22,8.64 14.11,8.83 | 13.77,8.64 14.11,8.44 | 14.11,8.44 | v14.22,8.64 14.11,8.44 | 13.77,8.64 14.11,8.83 | v14.22,8.64 14.11,8.83 | 13.77,8.64 14.11,8.44 | v14.22,8.64 14.11,8.44 | 13.77,8.64 14.11,8.83 | v14.22,8.64 14.11,8.83 | 12.8,15.24 | 12.8,15.24 13.15,15.04 | v13.26,15.24 13.15,15.04 | 12.8,15.24 | 12.8,15.24 13.15,15.44 | v13.26,15.24 13.15,15.44 | 12.8,15.24 13.15,15.04 | 13.15,15.04 | v13.26,15.24 13.15,15.04 | 12.8,15.24 13.15,15.44 | v13.26,15.24 13.15,15.44 | 12.8,15.24 13.15,15.04 | v13.26,15.24 13.15,15.04 | 12.8,15.24 13.15,15.44 | v13.26,15.24 13.15,15.44
  22 0.254: 19.71,27.79 19.81,27.69 20.26,27.69 | 19.71,27.79 v19.3,28.19 | v20.83,27.69 20.26,27.69 | 17.68,10.31 17.02,9.65 15.24,9.65 14.55,8.96 | 17.68,10.31 v18.09,10.72 | v14.22,8.64 14.55,8.96 | v13.26,15.24 13.61,15.24 13.71,15.33 | 13.71,15.33 13.82,15.44 13.82,17.12 13.06,17.88 10.57,17.88 10.16,18.29 3.56,18.29 3.05,18.8 3.05,19.91 3.45,20.32 4.42,20.32 4.47,20.32 J2.P7 | 19.71,27.79 19.55,28.27 v19.3,28.19 | 19.71,27.79 19.23,27.94 v19.3,28.19 | 20.26,27.69 | 20.26,27.69 20.71,27.45 | v20.83,27.69 20.71,27.45 | 20.26,27.69 | 20.26,27.69 20.71,27.92 | v20.83,27.69 20.71,27.92 | 20.26,27.69 20.71,27.45 | 20.71,27.45 | v20.83,27.69 20.71,27.45 | 20.26,27.69 20.71,27.92 | v20.83,27.69 20.71,27.92 | 20.26,27.69 20.71,27.45 | v20.83,27.69 20.71,27.45 | 20.26,27.69 20.71,27.92 | v20.83,27.69 20.71,27.92 | 17.68,10.31 18.16,10.47 v18.09,10.72 | 17.68,10.31 17.83,10.8 v18.09,10.72 | 14.55,8.96 14.16,8.85 v14.22,8.64 | 14.55,8.96 14.44,8.58 v14.22,8.64 | 13.71,15.33 13.33,15.45 v13.26,15.24 | 13.71,15.33 13.41,15.07 v13.26,15.24
CMOS_STBY  (via drill 0.38)
  Top 0.254: v17.27,21.34 17.68,21.74 | 17.68,21.74 20.15,24.21 U3.137 | 17.68,21.74 17.19,21.59 v17.27,21.34 | 17.68,21.74 17.52,21.26 v17.27,21.34
  22 0.15: 17.02,21.18 v17.27,21.34
  22 0.254: 16.72,21.18 8.94,21.18 8.08,20.32 7.37,20.32 7.32,20.37 J2.P8 | 16.72,21.18 17.02,21.18 | 16.72,21.18 17.22,21.08 v17.27,21.34 17.09,21.53 16.72,21.18
CMOS_TWCK  (via drill 0.38)
  Top 0.254: J2.P10 8.53,19.1 8.94,19.51 | 8.94,19.51 v9.35,19.91 | U3.74 33.7,10.8 33.53,10.97 33.53,11.58 32.72,12.39 32.47,12.39 | 32.47,12.39 32,12.39 v31.9,12.5 | 8.94,19.51 9.43,19.66 v9.35,19.91 | 8.94,19.51 9.1,19.99 v9.35,19.91 | 32.47,12.39 32.06,12.71 v31.9,12.5 | 32.47,12.39 31.98,12.24 v31.9,12.5
  22 0.254: v9.35,19.91 9.75,19.91 9.9,19.77 | 9.9,19.77 10.77,18.9 13.61,18.9 14.83,17.68 14.83,14.83 15.65,14.02 20.12,14.02 20.32,14.22 31.09,14.22 31.9,13.41 31.9,13.07 | 31.9,13.07 v31.9,12.5 | 9.9,19.77 9.52,20.11 v9.35,19.91 | 9.9,19.77 9.4,19.66 v9.35,19.91 | 31.9,13.07 | 31.9,13.07 31.67,12.62 | v31.9,12.5 31.67,12.62 | 31.9,13.07 | 31.9,13.07 32.14,12.62 | v31.9,12.5 32.14,12.62 | 31.9,13.07 31.67,12.62 | 31.67,12.62 | v31.9,12.5 31.67,12.62 | 31.9,13.07 32.14,12.62 | v31.9,12.5 32.14,12.62 | 31.9,13.07 31.67,12.62 | v31.9,12.5 31.67,12.62 | 31.9,13.07 32.14,12.62 | v31.9,12.5 32.14,12.62
CMOS_TWD
  Top 0.254: J2.P9 5.28,18.29 5.28,13.61 4.06,12.39 4.06,5.28 4.47,4.88 4.47,1.63 5.33,0.76 35.31,0.76 36.78,2.23 36.78,7.72 37.59,8.53 37.59,9.75 37.05,10.3 U3.73
GND  (via drill 0.3, 0.38)
  other vias: 8.13,17.17 9.55,10.36 37.49,11.07 31.29,21.95 27.23,19.91 33.32,22.15 5.99,17.58 2.74,20.83 23.88,13.41
  pour 22: 0.2,42.27 54.86,42.27 54.86,0.2 0.2,0.2
  pour Top: 0.2,42.27 54.86,42.27 54.86,0.2 0.2,0.2
JTAG_TCK  (via drill 0.38)
  Top 0.203: U3.1 13.25,27.8 12.8,28.25 11.58,28.25 9.75,26.42 1.93,26.42 1.22,25.7 1.22,17.07 1.63,16.66 1.66,16.66 | v2.23,16.66 1.66,16.66 | 1.66,16.66 | 1.66,16.66 | 1.66,16.66 2.09,16.41 | v2.23,16.66 2.09,16.41 | 1.66,16.66 2.09,16.91 | v2.23,16.66 2.09,16.91 | 1.66,16.66 2.09,16.41 | v2.23,16.66 2.09,16.41 | 1.66,16.66 2.09,16.91 | v2.23,16.66 2.09,16.91 | 1.66,16.66 2.09,16.41 | v2.23,16.66 2.09,16.41 | 1.66,16.66 2.09,16.91 | v2.23,16.66 2.09,16.91
  22 0.203: JTAG.3 2.34,8.86 2.95,9.47 2.95,15.95 2.64,16.26 | 2.64,16.26 v2.23,16.66 | 2.64,16.26 2.52,16.73 v2.23,16.66 | 2.64,16.26 2.16,16.38 v2.23,16.66
JTAG_TDI  (via drill 0.38)
  Top 0.203: v11.99,27.43 12.39,27.43 12.53,27.3 12.54,27.3 | U3.2 12.54,27.3 | 12.54,27.3 12.19,27.64 | v11.99,27.43 12.19,27.64 | 12.54,27.3 12.07,27.16 | v11.99,27.43 12.07,27.16 | 12.54,27.3 12.19,27.64 | v11.99,27.43 12.19,27.64 | 12.54,27.3 12.07,27.16 | v11.99,27.43 12.07,27.16
  22 0.203: 11.42,27.43 3.25,27.43 1.02,25.2 1.02,12.78 1.93,11.86 JTAG.5 | 11.42,27.43 | 11.42,27.43 v11.99,27.43 | 11.42,27.43 | 11.42,27.43 11.84,27.18 | v11.99,27.43 11.84,27.18 | 11.42,27.43 11.84,27.68 | v11.99,27.43 11.84,27.68 | 11.42,27.43 11.84,27.18 | v11.99,27.43 11.84,27.18 | 11.42,27.43 11.84,27.68 | v11.99,27.43 11.84,27.68 | 11.42,27.43 11.84,27.18 | v11.99,27.43 11.84,27.18 | 11.42,27.43 11.84,27.68 | v11.99,27.43 11.84,27.68
JTAG_TDO  (via drill 0.38)
  Top 0.203: U3.3 13.03,26.8 13.01,26.82 12.19,26.01 2.23,26.01 1.63,25.4 1.63,17.68 1.83,17.48 2.48,17.48 | v3.05,17.48 2.48,17.48 | 2.48,17.48 | 2.48,17.48 | 2.48,17.48 2.9,17.23 | v3.05,17.48 2.9,17.23 | 2.48,17.48 2.9,17.72 | v3.05,17.48 2.9,17.72 | 2.48,17.48 2.9,17.23 | v3.05,17.48 2.9,17.23 | 2.48,17.48 2.9,17.72 | v3.05,17.48 2.9,17.72 | 2.48,17.48 2.9,17.23 | v3.05,17.48 2.9,17.23 | 2.48,17.48 2.9,17.72 | v3.05,17.48 2.9,17.72
  22 0.203: JTAG.2 2.89,7.36 3.35,7.82 3.35,16.56 3.05,16.87 3.05,16.9 | v3.05,17.48 3.05,16.9 | 3.05,16.9 | 3.05,16.9 3.3,17.33 | v3.05,17.48 3.3,17.33 | 3.05,16.9 | 3.05,16.9 2.8,17.33 | v3.05,17.48 2.8,17.33 | 3.05,16.9 3.3,17.33 | v3.05,17.48 3.3,17.33 | 3.05,16.9 2.8,17.33 | v3.05,17.48 2.8,17.33 | 3.05,16.9 3.3,17.33 | v3.05,17.48 3.3,17.33 | 3.05,16.9 2.8,17.33 | v3.05,17.48 2.8,17.33
JTAG_TMS  (via drill 0.38)
  Top 0.203: U3.4 13.53,26.3 13.51,26.31 12.8,25.6 2.64,25.6 2.03,24.99 2.03,19.51 3.66,17.88 | v4.06,17.48 3.66,17.88 | 3.66,17.88 3.78,17.4 v4.06,17.48 | 3.66,17.88 4.14,17.75 v4.06,17.48
  22 0.203: 4.06,16.9 4.06,16.05 3.76,15.75 3.76,6.2 3.42,5.86 JTAG.1 | 4.06,16.9 | 4.06,16.9 v4.06,17.48 | 4.06,16.9 4.31,17.33 | v4.06,17.48 4.31,17.33 | 4.06,16.9 | 4.06,16.9 3.81,17.33 | v4.06,17.48 3.81,17.33 | 4.06,16.9 4.31,17.33 | v4.06,17.48 4.31,17.33 | 4.06,16.9 3.81,17.33 | v4.06,17.48 3.81,17.33 | 4.06,16.9 4.31,17.33 | v4.06,17.48 4.31,17.33 | 4.06,16.9 3.81,17.33 | v4.06,17.48 3.81,17.33
LED_FLASH1  (via drill 0.3)
  Top 0.254: v32.11,17.27 32.56,17.27 | 32.56,17.27 35.97,17.27 U3.87 | 32.56,17.27 32.22,17.47 | v32.11,17.27 32.22,17.47 | 32.56,17.27 32.22,17.08 | v32.11,17.27 32.22,17.08 | 32.56,17.27 32.22,17.47 | 32.22,17.47 | v32.11,17.27 32.22,17.47 | 32.56,17.27 32.22,17.08 | v32.11,17.27 32.22,17.08 | 32.56,17.27 32.22,17.47 | v32.11,17.27 32.22,17.47 | 32.56,17.27 32.22,17.08 | v32.11,17.27 32.22,17.08
  22 0.254: 31.65,17.27 21.64,17.27 20.52,18.39 20.52,23.47 19,24.99 5.89,24.99 5.69,24.79 5.69,24.38 5.49,24.18 J2.P1 | 31.65,17.27 v32.11,17.27 | 31.65,17.27 | 31.65,17.27 31.99,17.08 | v32.11,17.27 31.99,17.08 | 31.65,17.27 | 31.65,17.27 31.99,17.47 | v32.11,17.27 31.99,17.47 | 31.65,17.27 31.99,17.08 | 31.99,17.08 | v32.11,17.27 31.99,17.08 | 31.65,17.27 31.99,17.47 | v32.11,17.27 31.99,17.47 | 31.65,17.27 31.99,17.08 | v32.11,17.27 31.99,17.08 | 31.65,17.27 31.99,17.47 | v32.11,17.27 31.99,17.47
LED_FLASH2  (via drill 0.38)
  Top 0.254: v33.73,18.29 34.3,18.29 | 34.3,18.29 35.99,18.29 U3.89 | 34.3,18.29 33.85,18.52 | v33.73,18.29 33.85,18.52 | 34.3,18.29 33.85,18.05 | v33.73,18.29 33.85,18.05 | 34.3,18.29 33.85,18.52 | 33.85,18.52 | v33.73,18.29 33.85,18.52 | 34.3,18.29 33.85,18.05 | v33.73,18.29 33.85,18.05 | 34.3,18.29 33.85,18.52 | v33.73,18.29 33.85,18.52 | 34.3,18.29 33.85,18.05 | v33.73,18.29 33.85,18.05
  22 0.254: 33.16,18.29 21.34,18.29 21.03,18.59 21.03,23.67 18.69,26.01 3.45,26.01 2.85,25.4 2.85,23.16 3.1,22.91 J2.P3 | 33.16,18.29 v33.73,18.29 | 33.16,18.29 | 33.16,18.29 33.61,18.05 | v33.73,18.29 33.61,18.05 | 33.16,18.29 | 33.16,18.29 33.61,18.52 | v33.73,18.29 33.61,18.52 | 33.16,18.29 33.61,18.05 | 33.61,18.05 | v33.73,18.29 33.61,18.05 | 33.16,18.29 33.61,18.52 | v33.73,18.29 33.61,18.52 | 33.16,18.29 33.61,18.05 | v33.73,18.29 33.61,18.05 | 33.16,18.29 33.61,18.52 | v33.73,18.29 33.61,18.52
LED_G  (via drill 0.38)
  Top 0.203: R2.1 10.21,6.35 11.38,7.52 15.07,7.52 | 15.07,7.52 | 15.07,7.52 v15.65,7.52 | U3.48 | 15.07,7.52 | 15.07,7.52 15.5,7.27 | v15.65,7.52 15.5,7.27 | 15.07,7.52 15.5,7.77 | v15.65,7.52 15.5,7.77 | 15.07,7.52 15.5,7.27 | v15.65,7.52 15.5,7.27 | 15.07,7.52 15.5,7.77 | v15.65,7.52 15.5,7.77 | 15.07,7.52 15.5,7.27 | v15.65,7.52 15.5,7.27 | 15.07,7.52 15.5,7.77 | v15.65,7.52 15.5,7.77
  Top 0.254: v21.74,11.79 22.15,11.38 | 22.15,11.38 U3.48 | 22.15,11.38 21.99,11.87 v21.74,11.79 | 22.15,11.38 21.66,11.53 v21.74,11.79
  22 0.254: 21.17,11.79 20.52,11.79 16.26,7.52 16.22,7.52 | 21.17,11.79 v21.74,11.79 | 16.22,7.52 v15.65,7.52 | 16.22,7.52 15.77,7.75 | v15.65,7.52 15.77,7.75 | 16.22,7.52 15.77,7.29 | v15.65,7.52 15.77,7.29 | 16.22,7.52 15.77,7.75 | 15.77,7.75 | v15.65,7.52 15.77,7.75 | 16.22,7.52 15.77,7.29 | v15.65,7.52 15.77,7.29 | 16.22,7.52 15.77,7.75 | v15.65,7.52 15.77,7.75 | 16.22,7.52 15.77,7.29 | v15.65,7.52 15.77,7.29 | 21.17,11.79 | 21.17,11.79 21.62,11.55 | v21.74,11.79 21.62,11.55 | 21.17,11.79 | 21.17,11.79 21.62,12.02 | v21.74,11.79 21.62,12.02 | 21.17,11.79 21.62,11.55 | 21.62,11.55 | v21.74,11.79 21.62,11.55 | 21.17,11.79 21.62,12.02 | v21.74,11.79 21.62,12.02 | 21.17,11.79 21.62,11.55 | v21.74,11.79 21.62,11.55 | 21.17,11.79 21.62,12.02 | v21.74,11.79 21.62,12.02
LED_R  (via drill 0.38)
  Top 0.203: R3.1 9.4,8.89 9.55,8.73 | 9.55,8.73 v9.96,8.33 | U3.47 | 9.55,8.73 9.68,8.26 v9.96,8.33 | 9.55,8.73 10.03,8.61 v9.96,8.33
  Top 0.254: v20.93,13.41 20.93,12.84 | 20.93,12.84 20.93,10.87 21.64,10.16 U3.47 | 20.93,12.84 21.16,13.29 | v20.93,13.41 21.16,13.29 | 20.93,12.84 20.7,13.29 | v20.93,13.41 20.7,13.29 | 20.93,12.84 21.16,13.29 | 21.16,13.29 | v20.93,13.41 21.16,13.29 | 20.93,12.84 20.7,13.29 | v20.93,13.41 20.7,13.29 | 20.93,12.84 21.16,13.29 | v20.93,13.41 21.16,13.29 | 20.93,12.84 20.7,13.29 | v20.93,13.41 20.7,13.29
  22 0.254: v9.96,8.33 10.53,8.33 | 10.53,8.33 12.39,8.33 12.8,8.74 12.8,9.96 13.01,10.16 14.22,10.16 15.04,10.97 15.04,12.8 15.65,13.41 20.36,13.41 | v20.93,13.41 20.36,13.41 | 10.53,8.33 10.08,8.56 | v9.96,8.33 10.08,8.56 | 10.53,8.33 10.08,8.1 | v9.96,8.33 10.08,8.1 | 10.53,8.33 10.08,8.56 | 10.08,8.56 | v9.96,8.33 10.08,8.56 | 10.53,8.33 10.08,8.1 | v9.96,8.33 10.08,8.1 | 10.53,8.33 10.08,8.56 | v9.96,8.33 10.08,8.56 | 10.53,8.33 10.08,8.1 | v9.96,8.33 10.08,8.1 | 20.36,13.41 | 20.36,13.41 20.81,13.18 | v20.93,13.41 20.81,13.18 | 20.36,13.41 | 20.36,13.41 20.81,13.64 | v20.93,13.41 20.81,13.64 | 20.36,13.41 20.81,13.18 | 20.81,13.18 | v20.93,13.41 20.81,13.18 | 20.36,13.41 20.81,13.64 | v20.93,13.41 20.81,13.64 | 20.36,13.41 20.81,13.18 | v20.93,13.41 20.81,13.18 | 20.36,13.41 20.81,13.64 | v20.93,13.41 20.81,13.64
N$1  (via drill 0.38)
  Top 0.254: 13.97,40.69 v13.97,40.64
  Top 0.381: L1.2 13.4,40.69 | 13.4,40.69 13.97,40.69 | 13.4,40.69 13.88,40.46 v13.97,40.64 13.92,40.83 13.4,40.69
  22 0.254: 23.37,34.35 C4.1
  22 0.381: 14.54,40.64 21.59,40.64 22.86,39.37 U1.1 22.86,36.47 23.37,35.97 24.18,35.97 24.59,35.56 24.59,34.54 24.39,34.35 23.37,34.35 | 14.54,40.64 v13.97,40.64 | 14.54,40.64 14.04,40.83 | v13.97,40.64 14.04,40.83 | 14.54,40.64 14.04,40.45 | v13.97,40.64 14.04,40.45 | 14.54,40.64 14.04,40.83 | 14.04,40.83 | 14.54,40.64 14.04,40.45 | v13.97,40.64 14.04,40.45 | 14.54,40.64 14.04,40.83 | v13.97,40.64 14.04,40.83 | 14.54,40.64 14.04,40.45 | v13.97,40.64 14.04,40.45
N$2  (via drill 0.38)
  Top 0.254: 8.89,27.94 7.62,27.94 L1.1 | 29.21,35.56 D1.C
  Top 0.381: 10.16,32.45 10.16,29.21 8.89,27.94 | 10.16,32.45 v10.16,33.02 | 29.26,35.51 29.21,35.56 | D1.C 29.21,34.09 28.85,33.73 25.75,33.73 | 25.75,33.73 25.65,33.73 v25.3,34.09 | 10.16,32.45 10.35,32.95 | v10.16,33.02 10.35,32.95 | 10.16,32.45 9.97,32.95 | v10.16,33.02 9.97,32.95 | 10.16,32.45 10.35,32.95 | 10.35,32.95 | 10.16,32.45 9.97,32.95 | v10.16,33.02 9.97,32.95 | 10.16,32.45 10.35,32.95 | v10.16,33.02 10.35,32.95 | 10.16,32.45 9.97,32.95 | v10.16,33.02 9.97,32.95 | 25.75,33.73 25.47,34.19 v25.3,34.09 | 25.75,33.73 25.24,33.9 v25.3,34.09
  22 0.254: 19.05,34.29 C3.1
  22 0.381: v10.16,33.02 10.73,33.02 | 10.73,33.02 19.91,33.02 | 19.91,33.02 24.38,33.02 24.98,33.61 | v25.3,34.09 25.3,33.93 24.98,33.61 | 19.05,34.29 19.76,34.29 19.91,34.14 19.91,33.02 | 10.73,33.02 10.23,33.21 | v10.16,33.02 10.23,33.21 | 10.73,33.02 10.23,32.83 | v10.16,33.02 10.23,32.83 | 10.73,33.02 10.23,33.21 | 10.23,33.21 | 10.73,33.02 10.23,32.83 | v10.16,33.02 10.23,32.83 | 10.73,33.02 10.23,33.21 | v10.16,33.02 10.23,33.21 | 10.73,33.02 10.23,32.83 | v10.16,33.02 10.23,32.83 | 24.98,33.61 25.41,33.92 v25.3,34.09 | 24.98,33.61 25.1,34.13 v25.3,34.09
N$3
  Top 0.381: D1.A 29.26,40.15 29.26,40.84 29.46,41.05 33.73,41.05 34.14,40.64 F1.2
N$4  (via drill 0.38)
  Top 0.254: U3.70 33.15,10.03 32.53,10.65 | 32.53,10.65 32.51,10.67 32.51,10.97 v32.31,11.18 | 32.53,10.65 32.57,11.15 v32.31,11.18 | 32.53,10.65 32.14,10.97 v32.31,11.18
  22 0.254: Y1.2 28.19,5.23 28.65,5.69 30.68,5.69 32.72,7.72 32.72,8.13 | 31.91,10.77 31.29,10.16 31.29,9.35 31.5,9.14 32.51,9.14 32.72,8.94 32.72,8.13 | 31.91,10.77 v32.31,11.18 | 32.72,8.13 32.51,8.33 31.43,8.33 C6.1 | 31.91,10.77 32.39,10.93 v32.31,11.18 | 31.91,10.77 32.06,11.26 v32.31,11.18
  22 0.305: 31.29,8.19 C6.1
N$5  (via drill 0.38)
  Top 0.254: U3.69 32.65,6.39 v32.61,6.35
  22 0.254: 35.23,4.14 35.56,3.81 36.17,3.81 | Y1.1 37.19,3.81 36.17,3.81 | 36.17,3.81 35.92,4.06 34.54,4.06 32.61,5.99 v32.61,6.35 32.61,6.71 34.24,8.33 35.52,8.33
  22 0.381: 35.52,8.33 C7.1 | 36.98,4.01 37.19,3.81
N$6
  Top 0.254: C9.2 C8.2 22.64,6.39 22.76,6.5 24.99,6.5 25.65,7.16 U3.55
N$7
  Top 0.203: 9.45,15.24 9.45,15.58 D2.1
  Top 0.254: R2.2 6.77,6.97 7.62,7.82 7.62,10.36 7.21,10.77 7.21,13.01 9.45,15.24
N$8
  Top 0.203: 7.92,15.04 7.92,15.46 D2.3
  Top 0.254: R3.2 6.77,13.88 7.92,15.04
N$9
  22 0.254: R4.2 6.08,1.63 7.32,1.63 7.59,1.91 U5.5
N$10  (via drill 0.38)
  Top 0.254: D3.C 13.48,4.95 14.02,5.49 | 14.02,5.49 16.87,5.49 | 16.87,5.49 17.03,5.49 | v15.49,8.89 15.9,9.29 | 15.9,9.29 16.15,9.55 16.15,11.58 15.95,11.79 14.81,11.79 U3.33 13.6,11.8 13.41,11.99 13.41,14.12 13.59,14.3 U3.28 | v13.36,6.35 13.36,6.15 13.65,5.86 | 13.65,5.86 14.02,5.49 | C11.1 16.93,5.42 16.87,5.49 | 15.9,9.29 15.41,9.14 v15.49,8.89 | 15.9,9.29 15.74,8.81 v15.49,8.89 | 13.65,5.86 13.62,6.36 v13.36,6.35 | 13.65,5.86 13.22,6.13 v13.36,6.35
  22 0.254: v15.49,8.89 15.49,8.79 15.14,8.44 | 15.14,8.44 13.82,7.11 13.82,6.81 13.77,6.75 | 13.77,6.75 v13.36,6.35 | 15.14,8.44 15.6,8.65 v15.49,8.89 | 15.14,8.44 15.23,8.94 v15.49,8.89 | 13.77,6.75 13.28,6.6 v13.36,6.35 | 13.77,6.75 13.61,6.27 v13.36,6.35
N$11
  Top 0.203: C12.2 12.23,11.01 12.39,11.18 12.39,11.28 12.39,11.38 | 14.78,11.28 U3.34
  Top 0.254: 12.39,11.28 14.78,11.28
N$12
  Top 0.203: 14.77,10.77 U3.35
  Top 0.254: C12.1 12.97,9.31 13.21,9.55 13.21,10.36 13.61,10.77 14.77,10.77
N$13
  22 0.305: J5.1 64.24,29.43 63.8,29.87 63.8,33.73 63.4,34.14 J3.5
N$14
  22 0.305: J5.2 67.01,30.93 67.26,30.68 67.26,28.65 66.85,28.25 63.6,28.25 63.2,28.65 63.2,31.09 62.79,31.5 60.71,31.5 J3.3
N$15
  22 0.305: J5.3 67.54,32.43 67.87,32.11 67.87,28.25 67.26,27.64 63.4,27.64 61.98,29.06 J3.1
N$16
  22 0.305: J5.4 64.62,33.93 63.2,35.36 59.28,35.36 J3.6
N$17
  22 0.305: J5.5 64.34,35.43 64.01,35.76 64.01,38.81 63.6,39.22 J3.9
N$18
  pour 22: 55.88,42.06 69.09,42.06 69.09,25.6 55.88,25.6
N$19
  22 0.305: J5.7 65.84,40.03 64.82,41.05 56.9,41.05 56.49,40.64 56.49,32.11 56.9,31.7 57.96,31.7 J3.4
RESETN  (via drill 0.38)
  Top 0.254: v17.48,31.09 17.68,30.89 | v5.89,4.88 6.46,4.88 | 6.46,4.88 9.75,4.88 10.97,6.1 11.99,6.1 12.39,5.69 12.39,5.25 | U3.142 17.65,30.55 | 17.65,30.55 17.65,30.91 v17.48,31.09 | 12.39,5.25 v12.39,4.67 | 17.65,30.55 17.73,31.05 v17.48,31.09 | 17.65,30.55 17.29,30.9 v17.48,31.09 | 6.46,4.88 6.01,5.11 | v5.89,4.88 6.01,5.11 | 6.46,4.88 6.01,4.64 | v5.89,4.88 6.01,4.64 | 6.46,4.88 6.01,5.11 | 6.01,5.11 | v5.89,4.88 6.01,5.11 | 6.46,4.88 6.01,4.64 | v5.89,4.88 6.01,4.64 | 6.46,4.88 6.01,5.11 | v5.89,4.88 6.01,5.11 | 6.46,4.88 6.01,4.64 | v5.89,4.88 6.01,4.64 | 12.39,5.25 | 12.39,5.25 12.16,4.79 | v12.39,4.67 12.16,4.79 | 12.39,5.25 | 12.39,5.25 12.63,4.79 | v12.39,4.67 12.63,4.79 | 12.39,5.25 12.16,4.79 | 12.16,4.79 | v12.39,4.67 12.16,4.79 | 12.39,5.25 12.63,4.79 | v12.39,4.67 12.63,4.79 | 12.39,5.25 12.16,4.79 | v12.39,4.67 12.16,4.79 | 12.39,5.25 12.63,4.79 | v12.39,4.67 12.63,4.79
  22 0.203: 16.9,31.09 4.27,31.09 0.61,27.43 0.61,11.58 1.83,10.36 JTAG.4 | 16.9,31.09 | 16.9,31.09 v17.48,31.09 | 16.9,31.09 | 16.9,31.09 17.33,30.84 | v17.48,31.09 17.33,30.84 | 16.9,31.09 17.33,31.34 | v17.48,31.09 17.33,31.34 | 16.9,31.09 17.33,30.84 | v17.48,31.09 17.33,30.84 | 16.9,31.09 17.33,31.34 | v17.48,31.09 17.33,31.34 | 16.9,31.09 17.33,30.84 | v17.48,31.09 17.33,30.84 | 16.9,31.09 17.33,31.34 | v17.48,31.09 17.33,31.34
  22 0.254: 12.8,4.27 13.89,3.17 U5.3 | 12.8,4.27 v12.39,4.67 | JTAG.4 1.02,9.25 1.02,5.08 1.22,4.88 5.32,4.88 | v5.89,4.88 5.32,4.88 | 5.32,4.88 | 5.32,4.88 5.77,4.64 | v5.89,4.88 5.77,4.64 | 5.32,4.88 | 5.32,4.88 5.77,5.11 | v5.89,4.88 5.77,5.11 | 5.32,4.88 5.77,4.64 | 5.77,4.64 | v5.89,4.88 5.77,4.64 | 5.32,4.88 5.77,5.11 | v5.89,4.88 5.77,5.11 | 5.32,4.88 5.77,4.64 | v5.89,4.88 5.77,4.64 | 5.32,4.88 5.77,5.11 | v5.89,4.88 5.77,5.11 | 12.8,4.27 12.65,4.75 v12.39,4.67 | 12.8,4.27 12.32,4.42 v12.39,4.67
SPI1-MISO  (via drill 0.38)
  Top 0.203: 27.64,8.46 U3.59
  Top 0.254: 27.64,8.46 27.64,9.75 27.43,9.96 27.43,11.58 26.82,12.19 | 26.82,12.19 v26.42,12.6 | 26.82,12.19 26.67,12.68 v26.42,12.6 | 26.82,12.19 26.34,12.35 v26.42,12.6
  22 0.254: 25.84,12.6 15.85,12.6 15.65,12.39 15.65,10.97 14.22,9.55 13.61,9.55 13.41,9.35 13.41,8.33 11.38,6.3 10.57,6.3 9.98,5.71 U5.8 | 25.84,12.6 v26.42,12.6 | 25.84,12.6 | 25.84,12.6 26.3,12.37 | v26.42,12.6 26.3,12.37 | 25.84,12.6 | 25.84,12.6 26.3,12.83 | v26.42,12.6 26.3,12.83 | 25.84,12.6 26.3,12.37 | 26.3,12.37 | v26.42,12.6 26.3,12.37 | 25.84,12.6 26.3,12.83 | v26.42,12.6 26.3,12.83 | 25.84,12.6 26.3,12.37 | v26.42,12.6 26.3,12.37 | 25.84,12.6 26.3,12.83 | v26.42,12.6 26.3,12.83
SPI1-MOSI  (via drill 0.38)
  Top 0.203: 27.13,8.47 U3.58
  Top 0.254: v26.42,11.18 26.42,10.6 | 26.42,10.6 26.42,10.26 27.13,9.55 27.13,8.47 | 26.42,10.6 26.65,11.05 | v26.42,11.18 26.65,11.05 | 26.42,10.6 26.18,11.05 | v26.42,11.18 26.18,11.05 | 26.42,10.6 26.65,11.05 | 26.65,11.05 | v26.42,11.18 26.65,11.05 | 26.42,10.6 26.18,11.05 | v26.42,11.18 26.18,11.05 | 26.42,10.6 26.65,11.05 | v26.42,11.18 26.65,11.05 | 26.42,10.6 26.18,11.05 | v26.42,11.18 26.18,11.05
  22 0.254: 25.88,10.97 20.73,10.97 19.91,10.16 19.91,8.13 17.5,5.71 U5.1 | 25.88,10.97 26.01,10.97 26.21,11.18 v26.42,11.18 | 25.88,10.97 26.39,10.91 v26.42,11.18 | 25.88,10.97 26.22,11.35 v26.42,11.18
SPI1-NPCS1  (via drill 0.38)
  Top 0.203: 29.67,8.47 U3.63
  Top 0.254: v29.67,10.77 29.67,10.2 | 29.67,10.2 29.67,8.47 | 29.67,10.2 29.9,10.65 | v29.67,10.77 29.9,10.65 | 29.67,10.2 29.43,10.65 | v29.67,10.77 29.43,10.65 | 29.67,10.2 29.9,10.65 | 29.9,10.65 | v29.67,10.77 29.9,10.65 | 29.67,10.2 29.43,10.65 | v29.67,10.77 29.43,10.65 | 29.67,10.2 29.9,10.65 | v29.67,10.77 29.9,10.65 | 29.67,10.2 29.43,10.65 | v29.67,10.77 29.43,10.65
  22 0.254: 29.26,10.37 28.45,9.55 21.54,9.55 21.13,9.14 21.13,7.72 19,5.59 19,4.67 | 29.26,10.37 v29.67,10.77 | R5.2 19,4.67 | U5.4 17.55,1.91 17.98,2.34 17.98,4.37 18.29,4.67 19,4.67 | 29.26,10.37 29.75,10.52 v29.67,10.77 | 29.26,10.37 29.42,10.85 v29.67,10.77
SPI1-SCK  (via drill 0.38)
  Top 0.203: v28.25,10.36 28.14,10.36 | U3.60
  Top 0.254: 28.14,10.36 28.14,9.8 | 28.14,9.8 U3.60 | 28.14,9.8 28.45,10.2 v28.25,10.36 27.99,10.29 28.14,9.8
  22 0.254: 27.67,10.36 21.13,10.36 20.52,9.75 20.52,7.92 18.09,5.49 18.09,5.08 17.45,4.45 U5.2 | 27.67,10.36 v28.25,10.36 | 27.67,10.36 | 27.67,10.36 28.12,10.13 | v28.25,10.36 28.12,10.13 | 27.67,10.36 | 27.67,10.36 28.12,10.6 | v28.25,10.36 28.12,10.6 | 27.67,10.36 28.12,10.13 | 28.12,10.13 | v28.25,10.36 28.12,10.13 | 27.67,10.36 28.12,10.6 | v28.25,10.36 28.12,10.6 | 27.67,10.36 28.12,10.13 | v28.25,10.36 28.12,10.13 | 27.67,10.36 28.12,10.6 | v28.25,10.36 28.12,10.6
TFT_CONNECTED
  Top 0.254: U3.80 38.02,13.8 39.22,12.6 39.22,7.92 38.41,7.11 38.41,3.45 38.81,3.05 48.97,3.05 49.38,3.45 49.38,4.06 48.16,5.28 48.16,7.92 47.83,8.26 J4.7
TFT_DB0
  Top 0.254: U3.92 38.11,19.8 38.41,19.51 38.41,16.26 41.45,13.21 41.45,12.19 41.58,12.06 J4.14
TFT_DB1
  Top 0.254: U3.93 38.22,20.3 38.91,19.61 38.91,16.36 41.94,13.34 J4.16
TFT_DB2
  Top 0.203: 43.16,14.63 J4.18
  Top 0.254: U3.94 38.33,20.8 39.42,19.71 39.42,16.46 41.25,14.63 43.16,14.63
TFT_DB3
  Top 0.254: U3.95 38.44,21.3 39.93,19.81 39.93,16.97 41.02,15.88 J4.20
TFT_DB4
  Top 0.254: U3.96 38.55,21.8 40.44,19.91 40.44,18.29 41.58,17.14 J4.22
TFT_DB5
  Top 0.254: U3.97 38.66,22.3 41.45,19.51 41.45,18.9 41.94,18.41 J4.24
TFT_DB6
  Top 0.254: U3.98 38.77,22.8 41.88,19.68 J4.26
TFT_DB7
  Top 0.254: U3.99 38.88,23.3 41.22,20.95 J4.28
TFT_DB8
  Top 0.178: 45.8,23.8 47.04,22.55
  Top 0.203: U3.100 45.8,23.8 | 47.04,22.55 47.04,21.23 46.76,20.95 J4.27
TFT_DB9
  Top 0.178: 45.91,24.3 47.45,22.76
  Top 0.203: U3.101 45.91,24.3 | 47.45,22.76 47.45,20.02 47.12,19.68 J4.25
TFT_DB10
  Top 0.178: 45.91,24.8 47.85,22.86
  Top 0.203: U3.102 45.91,24.8 | 47.85,22.86 47.85,19 47.27,18.41 J4.23
TFT_DB11
  Top 0.178: 46.02,25.2 48.26,22.96
  Top 0.203: U3.105 41.98,26.3 43.08,25.2 46.02,25.2 | 48.26,22.96 48.26,18.39 47.02,17.14 J4.21
TFT_DB12
  Top 0.178: 46.13,25.6 48.77,22.96
  Top 0.203: U3.106 42.09,26.8 43.28,25.6 46.13,25.6 | 48.77,22.96 48.77,17.27 47.37,15.88 J4.19
TFT_DB13
  Top 0.178: 46.33,26.01 51,21.34
  Top 0.203: U3.107 42.19,27.3 43.48,26.01 46.33,26.01 | 51,21.34 51,17.68 47.93,14.61 J4.17
TFT_DB14
  Top 0.178: 46.43,26.42 51.61,21.23
  Top 0.203: U3.108 42.3,27.8 43.69,26.42 46.43,26.42 | 51.61,21.23 51.61,17.37 47.57,13.34 J4.15
TFT_DB15  (via drill 0.38)
  Top 0.178: 52.63,20.73 46.53,26.82
  Top 0.203: v52.63,16.26 52.63,16.83 | 52.63,16.83 | 52.63,16.83 52.63,20.73 | 46.53,26.82 43.89,26.82 42.27,28.45 37.59,28.45 | 37.59,28.45 v37.19,28.85 | v35.15,29.67 34.58,29.67 | 34.58,29.67 | 34.58,29.67 34.17,29.67 U3.109 | 52.63,16.83 | 52.63,16.83 52.38,16.4 | v52.63,16.26 52.38,16.4 | 52.63,16.83 52.88,16.4 | v52.63,16.26 52.88,16.4 | 52.63,16.83 52.38,16.4 | v52.63,16.26 52.38,16.4 | 52.63,16.83 52.88,16.4 | v52.63,16.26 52.88,16.4 | 52.63,16.83 52.38,16.4 | v52.63,16.26 52.38,16.4 | 52.63,16.83 52.88,16.4 | v52.63,16.26 52.88,16.4 | 37.59,28.45 37.47,28.93 v37.19,28.85 | 37.59,28.45 37.11,28.57 v37.19,28.85 | 34.58,29.67 | 34.58,29.67 35.01,29.42 | v35.15,29.67 35.01,29.42 | 34.58,29.67 35.01,29.92 | v35.15,29.67 35.01,29.92 | 34.58,29.67 35.01,29.42 | v35.15,29.67 35.01,29.42 | 34.58,29.67 35.01,29.92 | v35.15,29.67 35.01,29.92 | 34.58,29.67 35.01,29.42 | v35.15,29.67 35.01,29.42 | 34.58,29.67 35.01,29.92 | v35.15,29.67 35.01,29.92
  22 0.254: v37.19,28.85 36.61,28.85 | 36.61,28.85 35.97,28.85 35.56,29.26 | 35.56,29.26 v35.15,29.67 | v52.63,16.26 52.63,15.68 | 52.63,15.68 52.63,13.01 51.69,12.06 J4.13 | 52.63,15.68 52.86,16.14 | v52.63,16.26 52.86,16.14 | 52.63,15.68 52.4,16.14 | v52.63,16.26 52.4,16.14 | 52.63,15.68 52.86,16.14 | 52.86,16.14 | v52.63,16.26 52.86,16.14 | 52.63,15.68 52.4,16.14 | v52.63,16.26 52.4,16.14 | 52.63,15.68 52.86,16.14 | v52.63,16.26 52.86,16.14 | 52.63,15.68 52.4,16.14 | v52.63,16.26 52.4,16.14 | 36.61,28.85 | 36.61,28.85 37.06,28.62 | v37.19,28.85 37.06,28.62 | 36.61,28.85 | 36.61,28.85 37.06,29.09 | v37.19,28.85 37.06,29.09 | 36.61,28.85 37.06,28.62 | 37.06,28.62 | v37.19,28.85 37.06,28.62 | 36.61,28.85 37.06,29.09 | v37.19,28.85 37.06,29.09 | 36.61,28.85 37.06,28.62 | v37.19,28.85 37.06,28.62 | 36.61,28.85 37.06,29.09 | v37.19,28.85 37.06,29.09 | 35.56,29.26 35.41,29.75 v35.15,29.67 | 35.56,29.26 35.07,29.42 v35.15,29.67
TFT_RS
  Top 0.254: U3.82 38.54,14.8 40.34,13.01 40.34,10.06 40.87,9.53 J4.10
TFT_X+  (via drill 0.38)